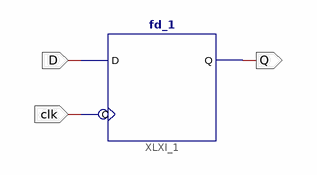
[diagram p0: schematic sheet 1]
// Xilinx ISE schematic D.sch (spartan3e) as structural Verilog: 1 symbols, 3 ports
module D (
  input  D,
  input  clk,
  output Q
);

  fd_1 XLXI_1 (.C(clk), .D(D), .Q(Q));
endmodule
